# Altium schematic sheet FPGA_IO.SchDoc: FPGA IO
size 635 x 635 mm; Organization: UCLA High Energy Physics; DocumentNumber: 9; Revision: 2.0; SheetNumber: 9; SheetTotal: 23; CurrentDate: 9/6/2018; ModifiedDate: 9/6/2018; ProjectName: ALCT S-6 Optical Mezzanine
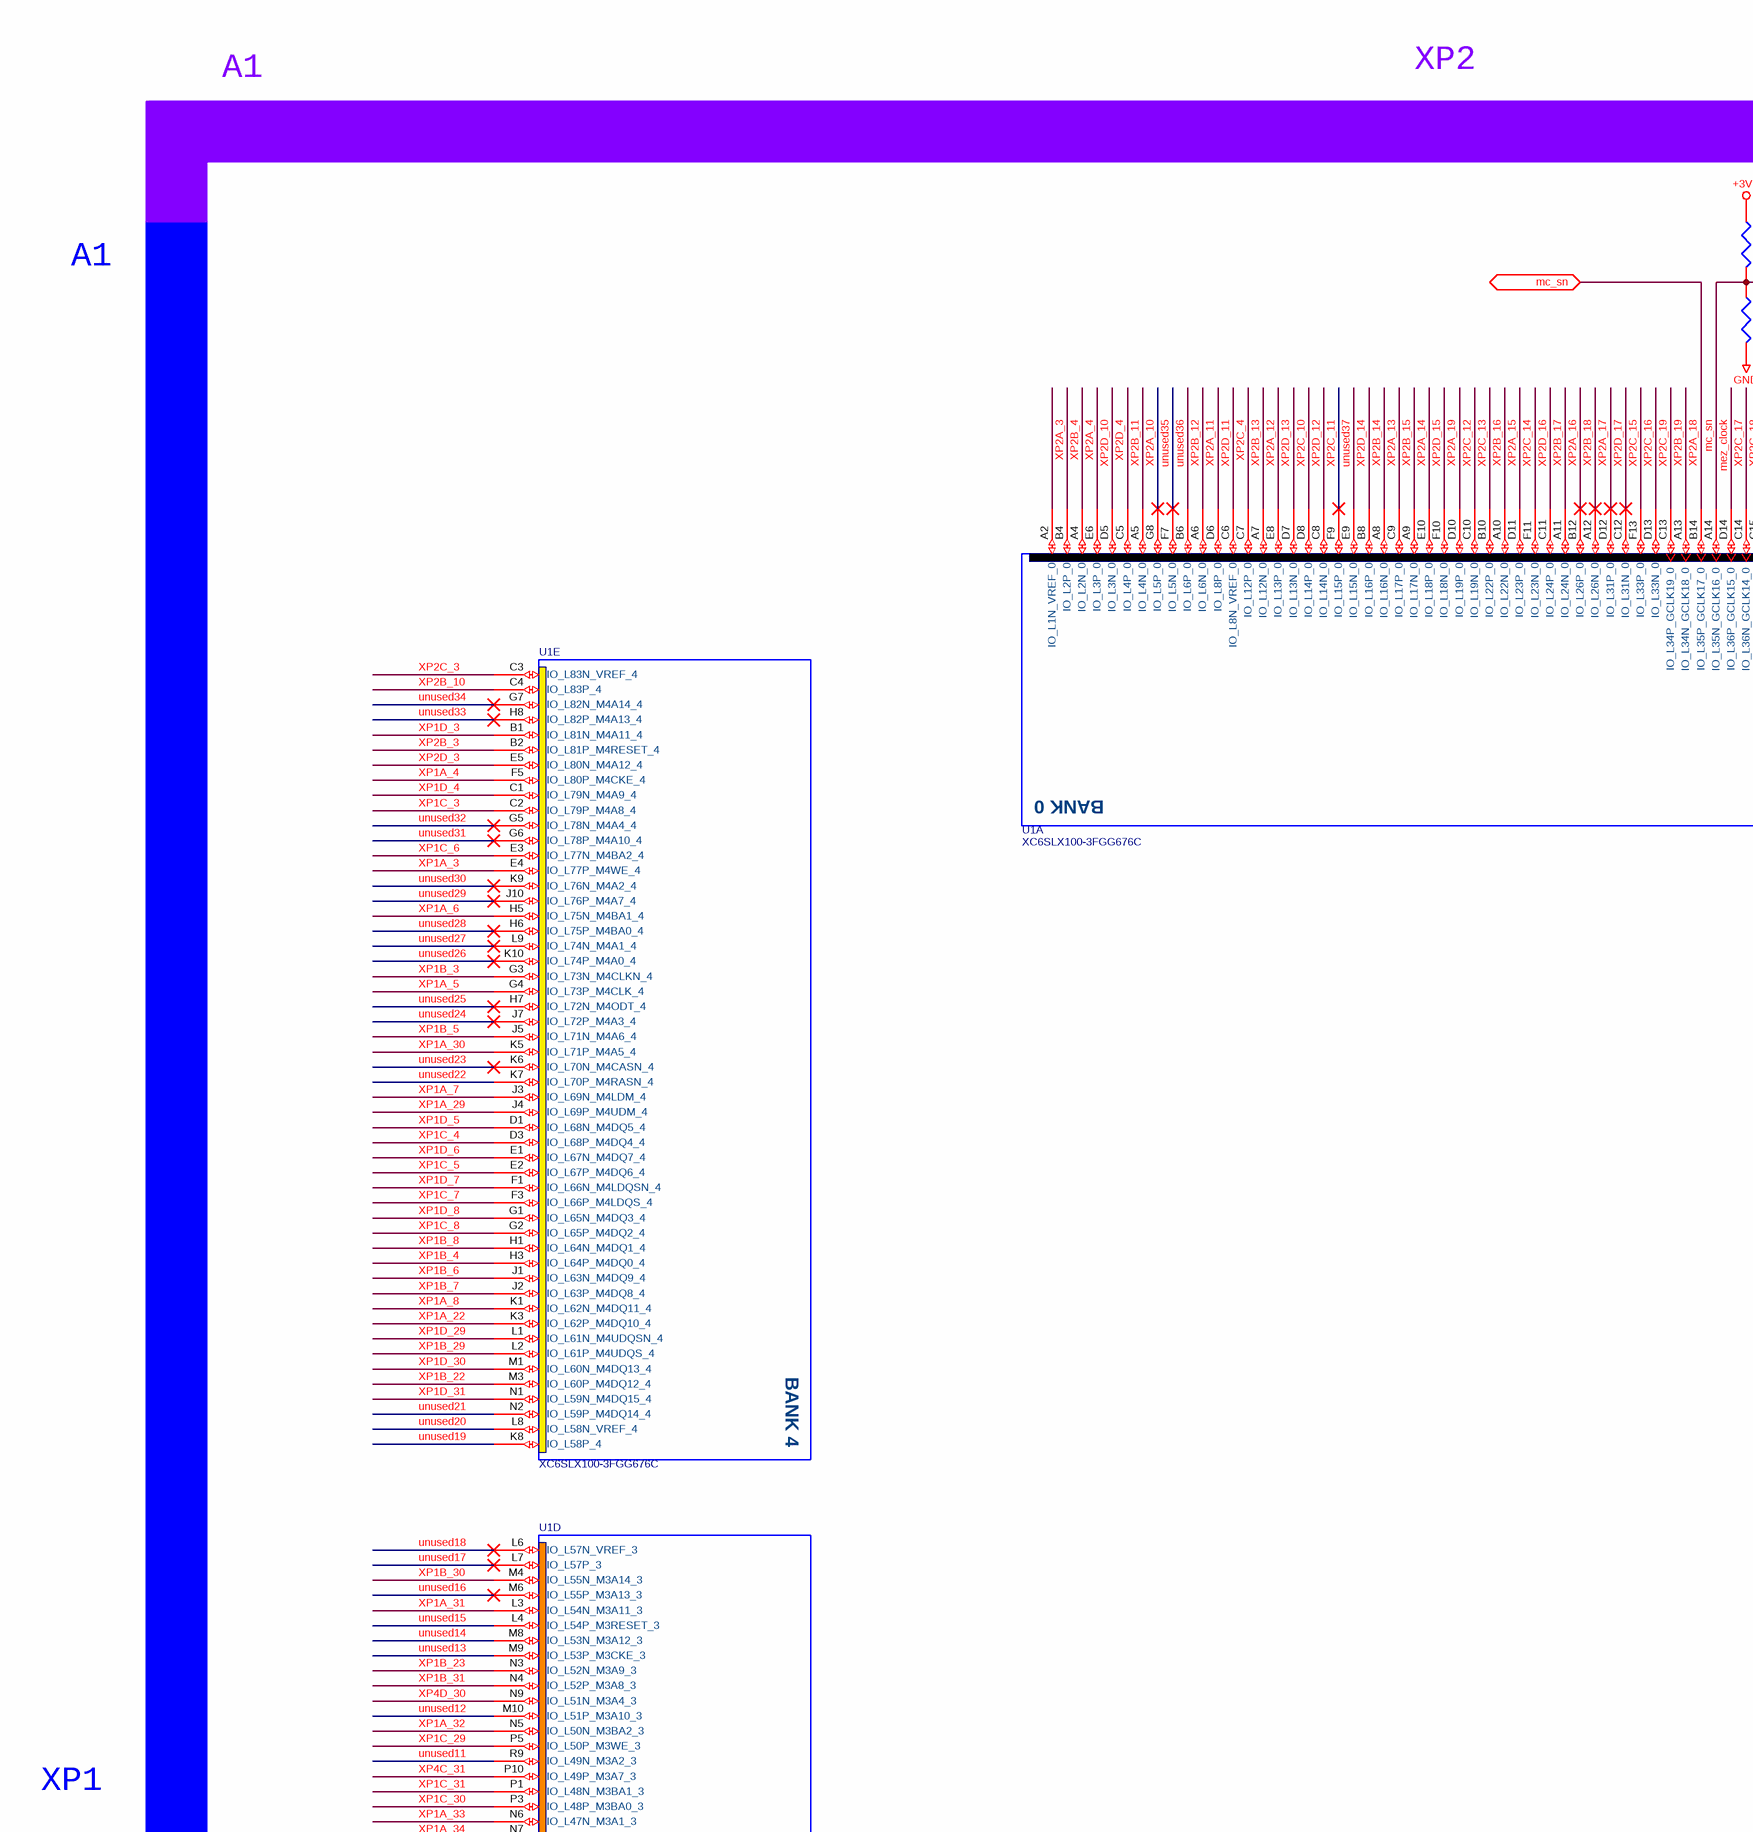
[diagram p0: FPGA_IO.SchDoc, top left]
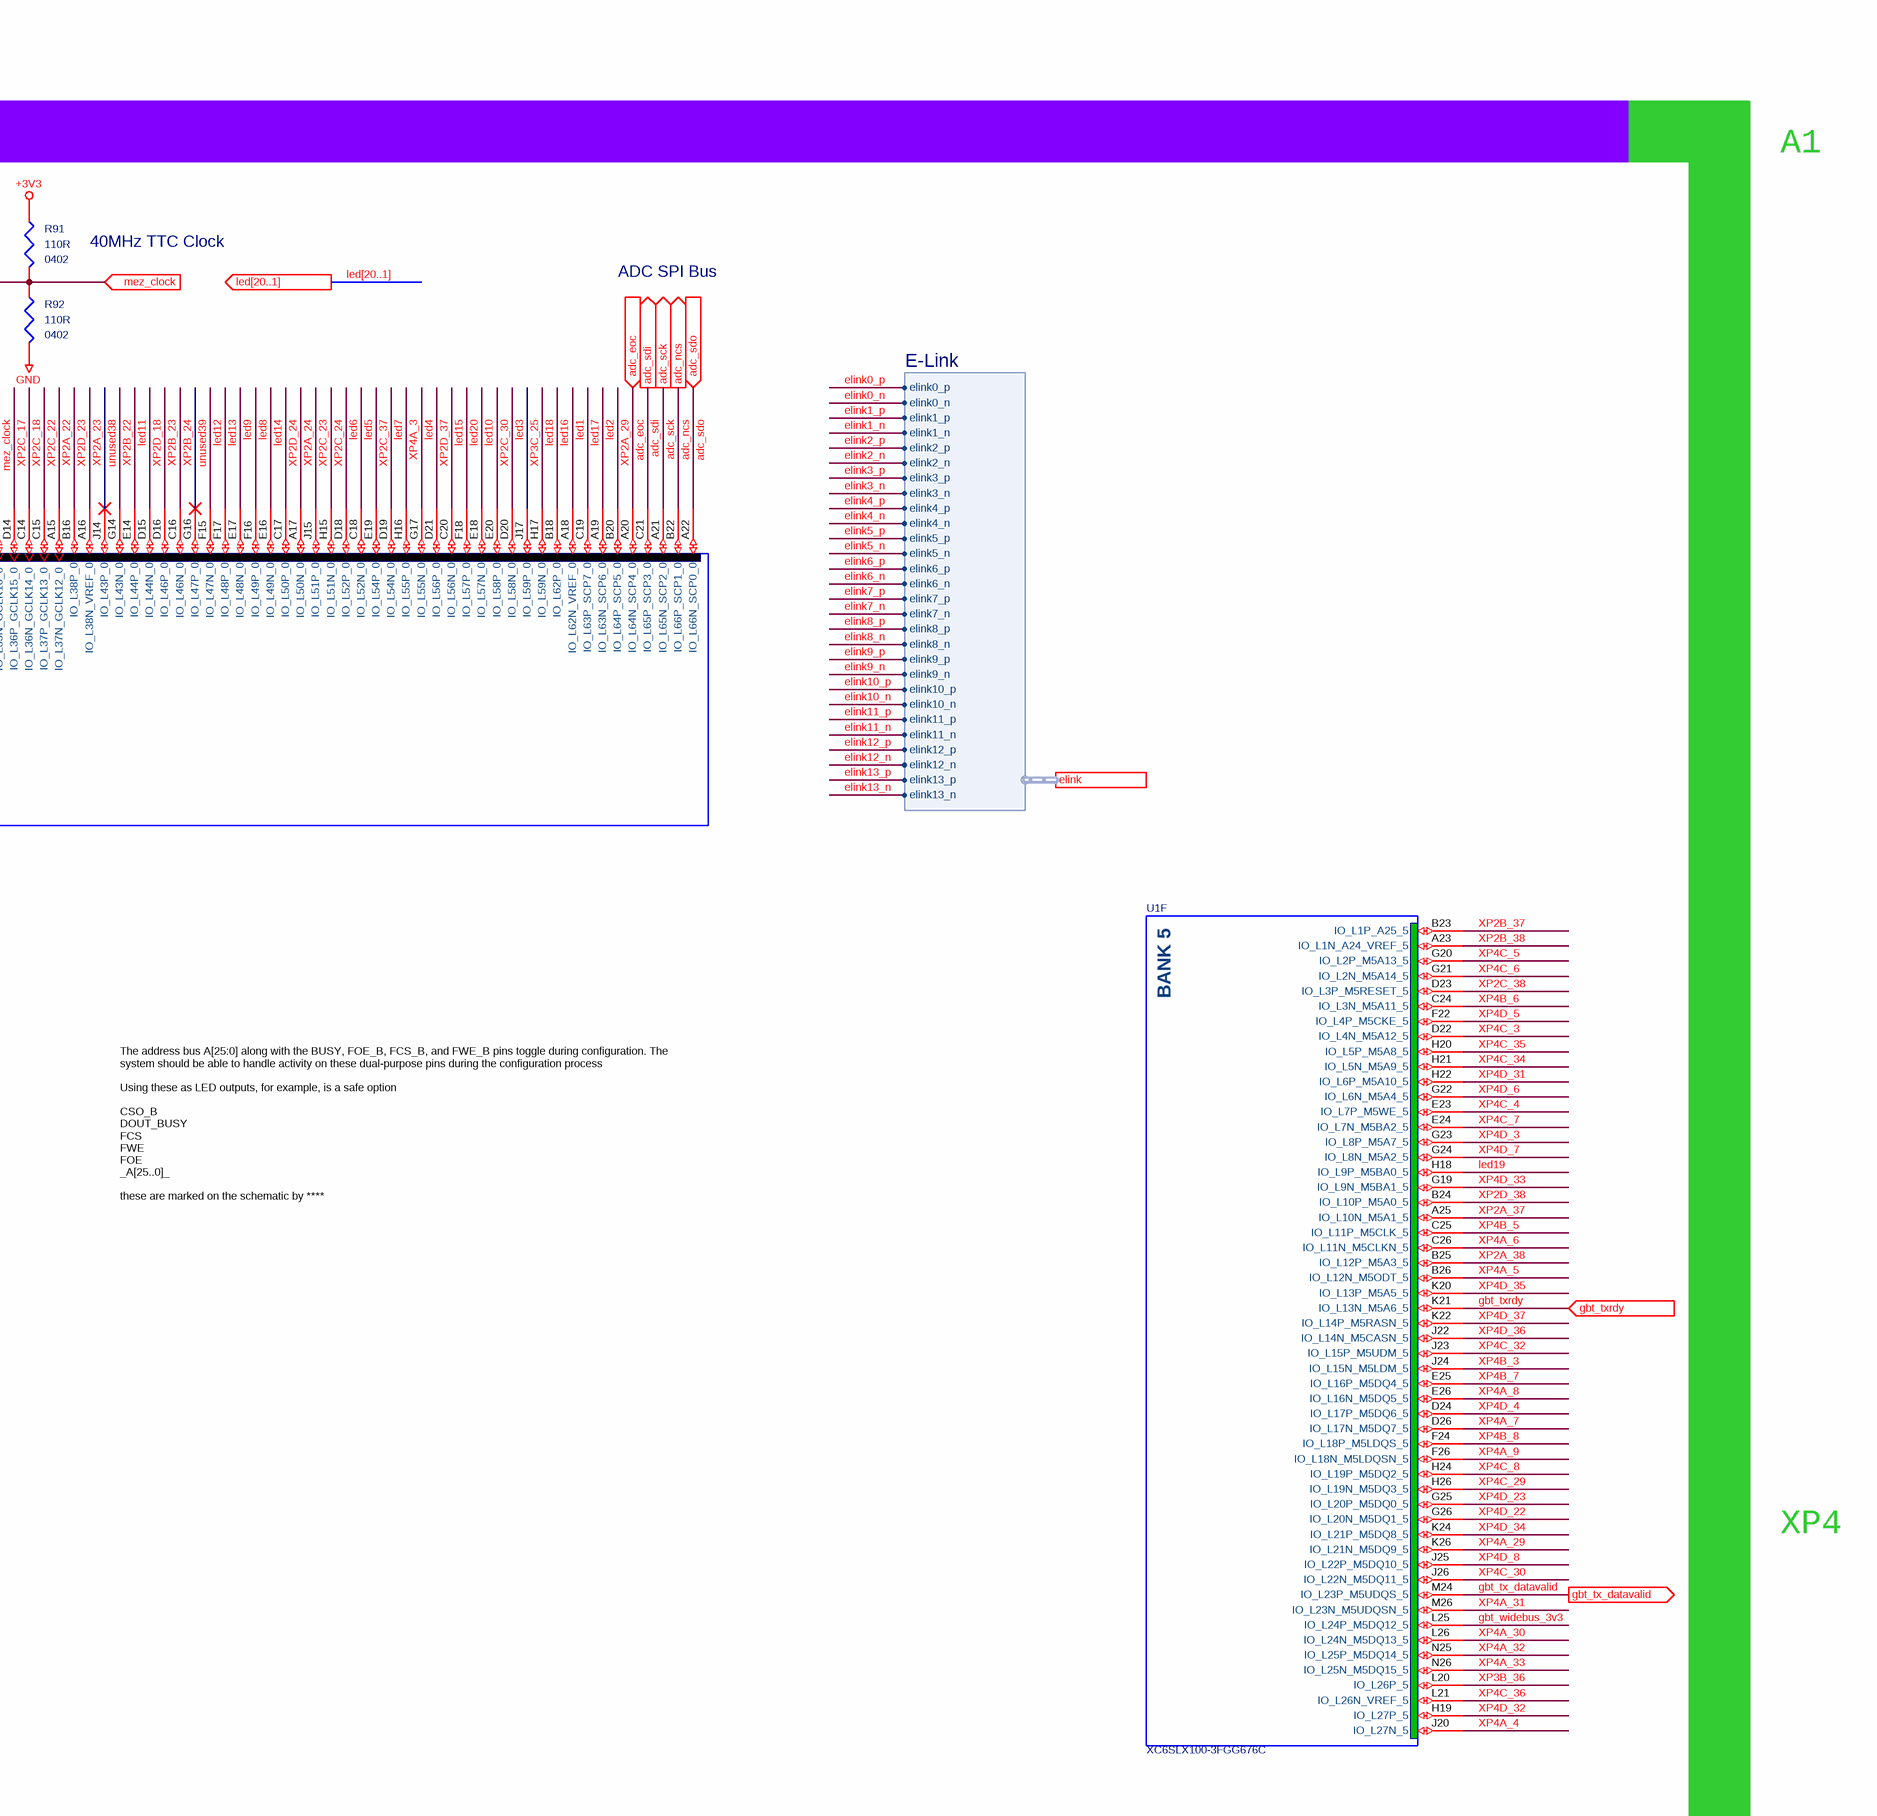
[diagram p1: FPGA_IO.SchDoc, top right]
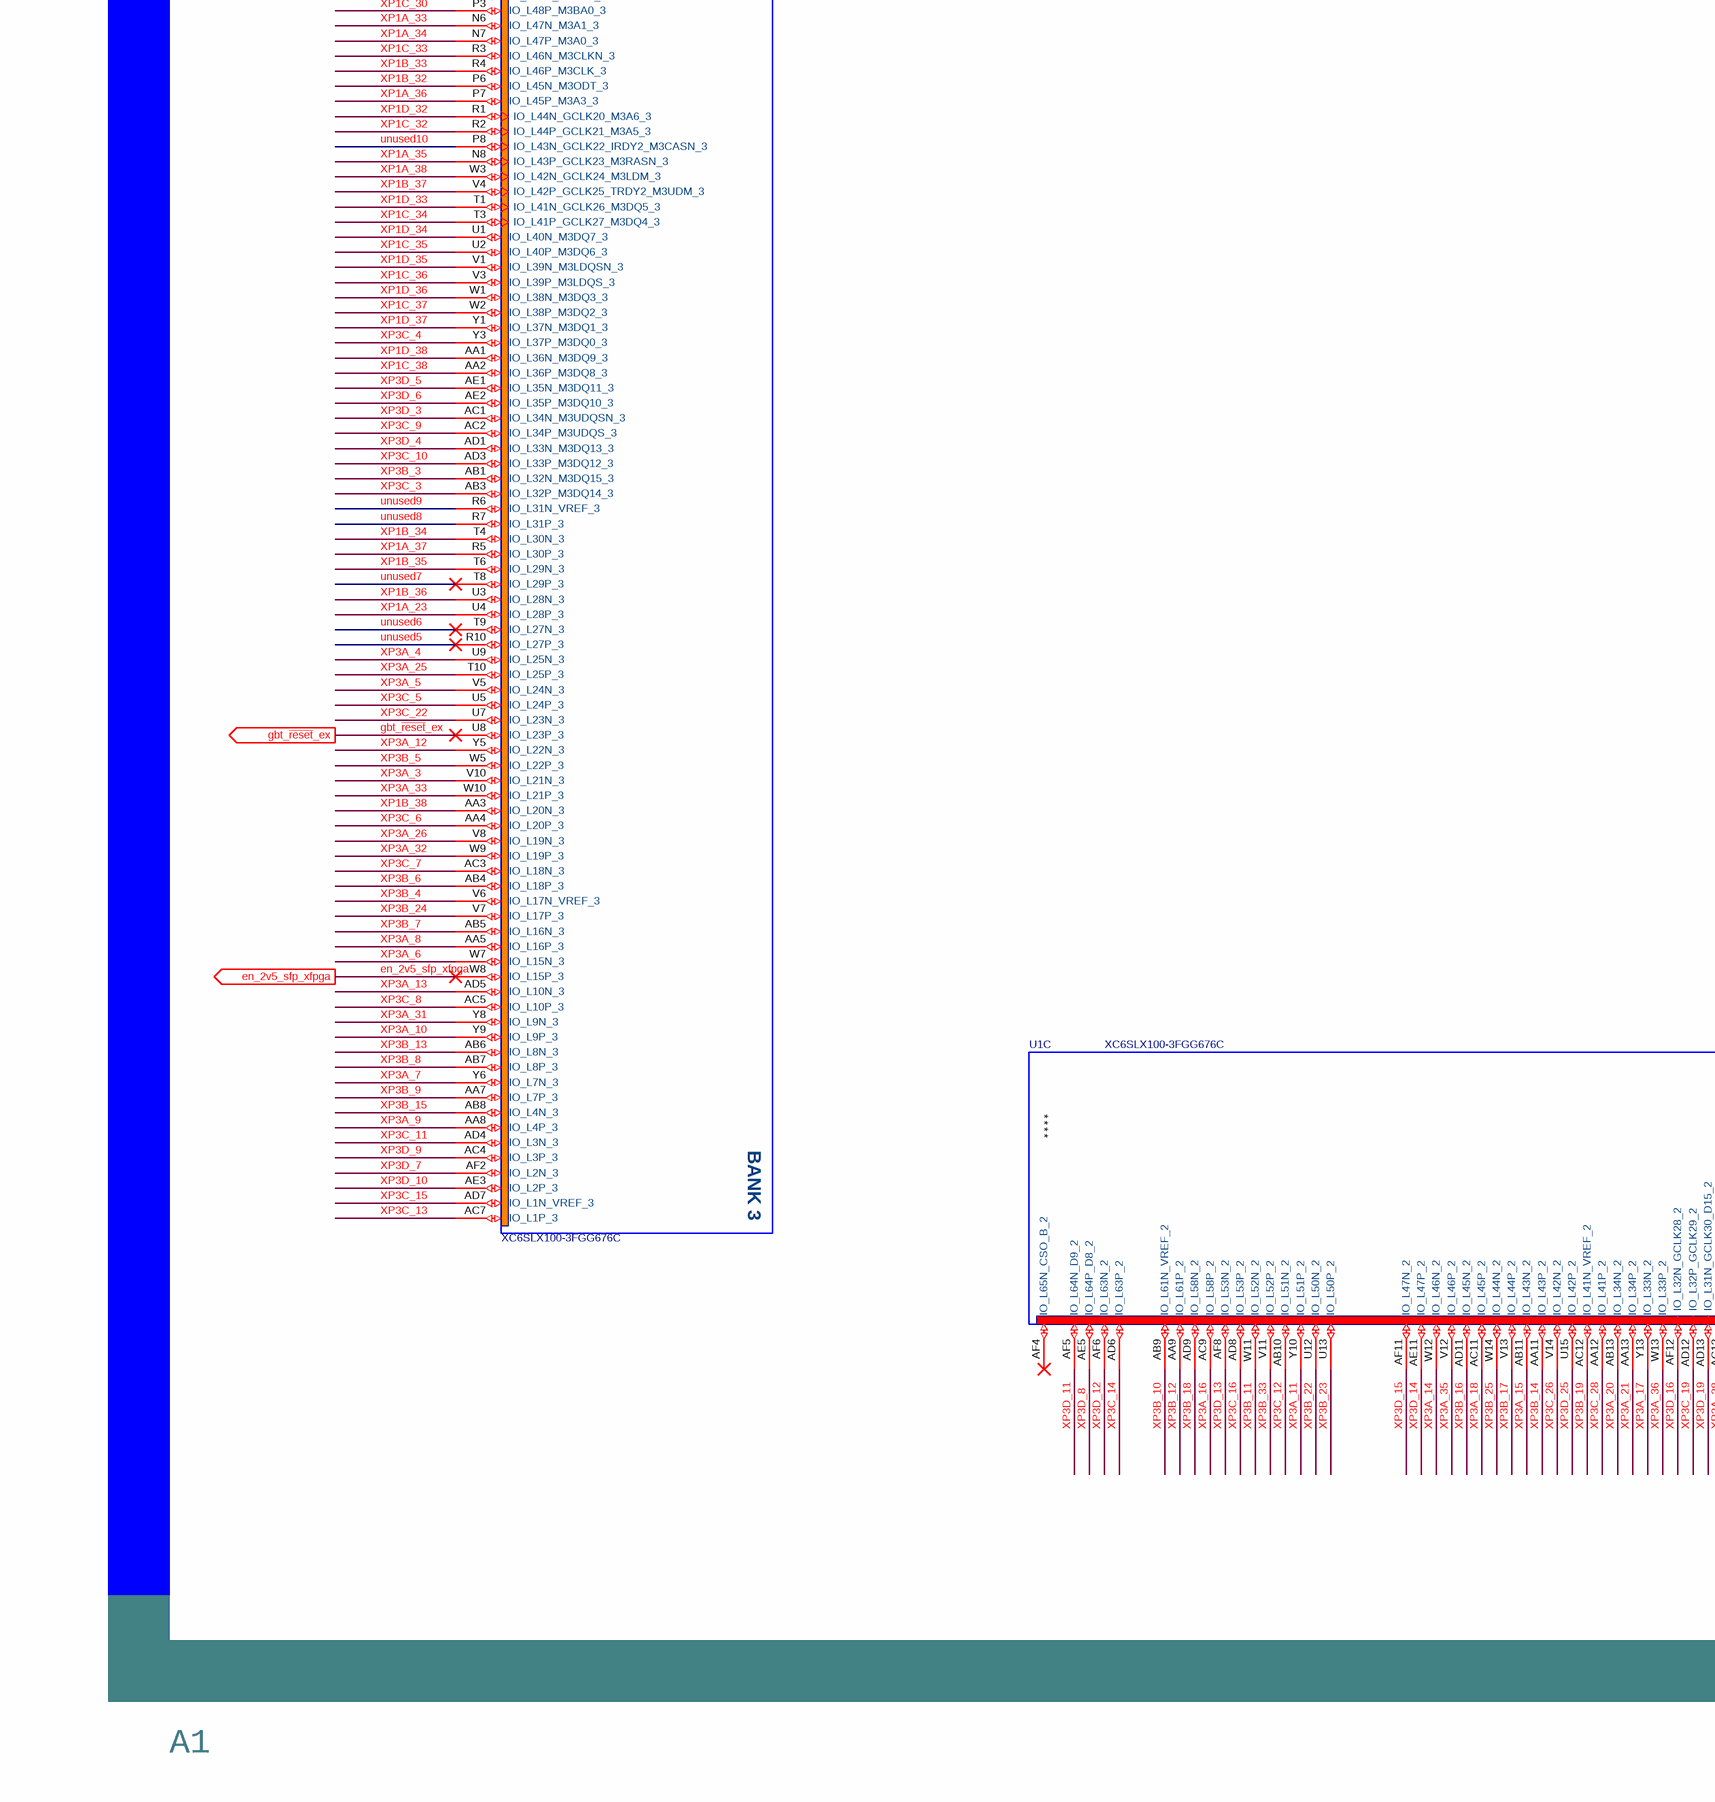
[diagram p2: FPGA_IO.SchDoc, bottom left]
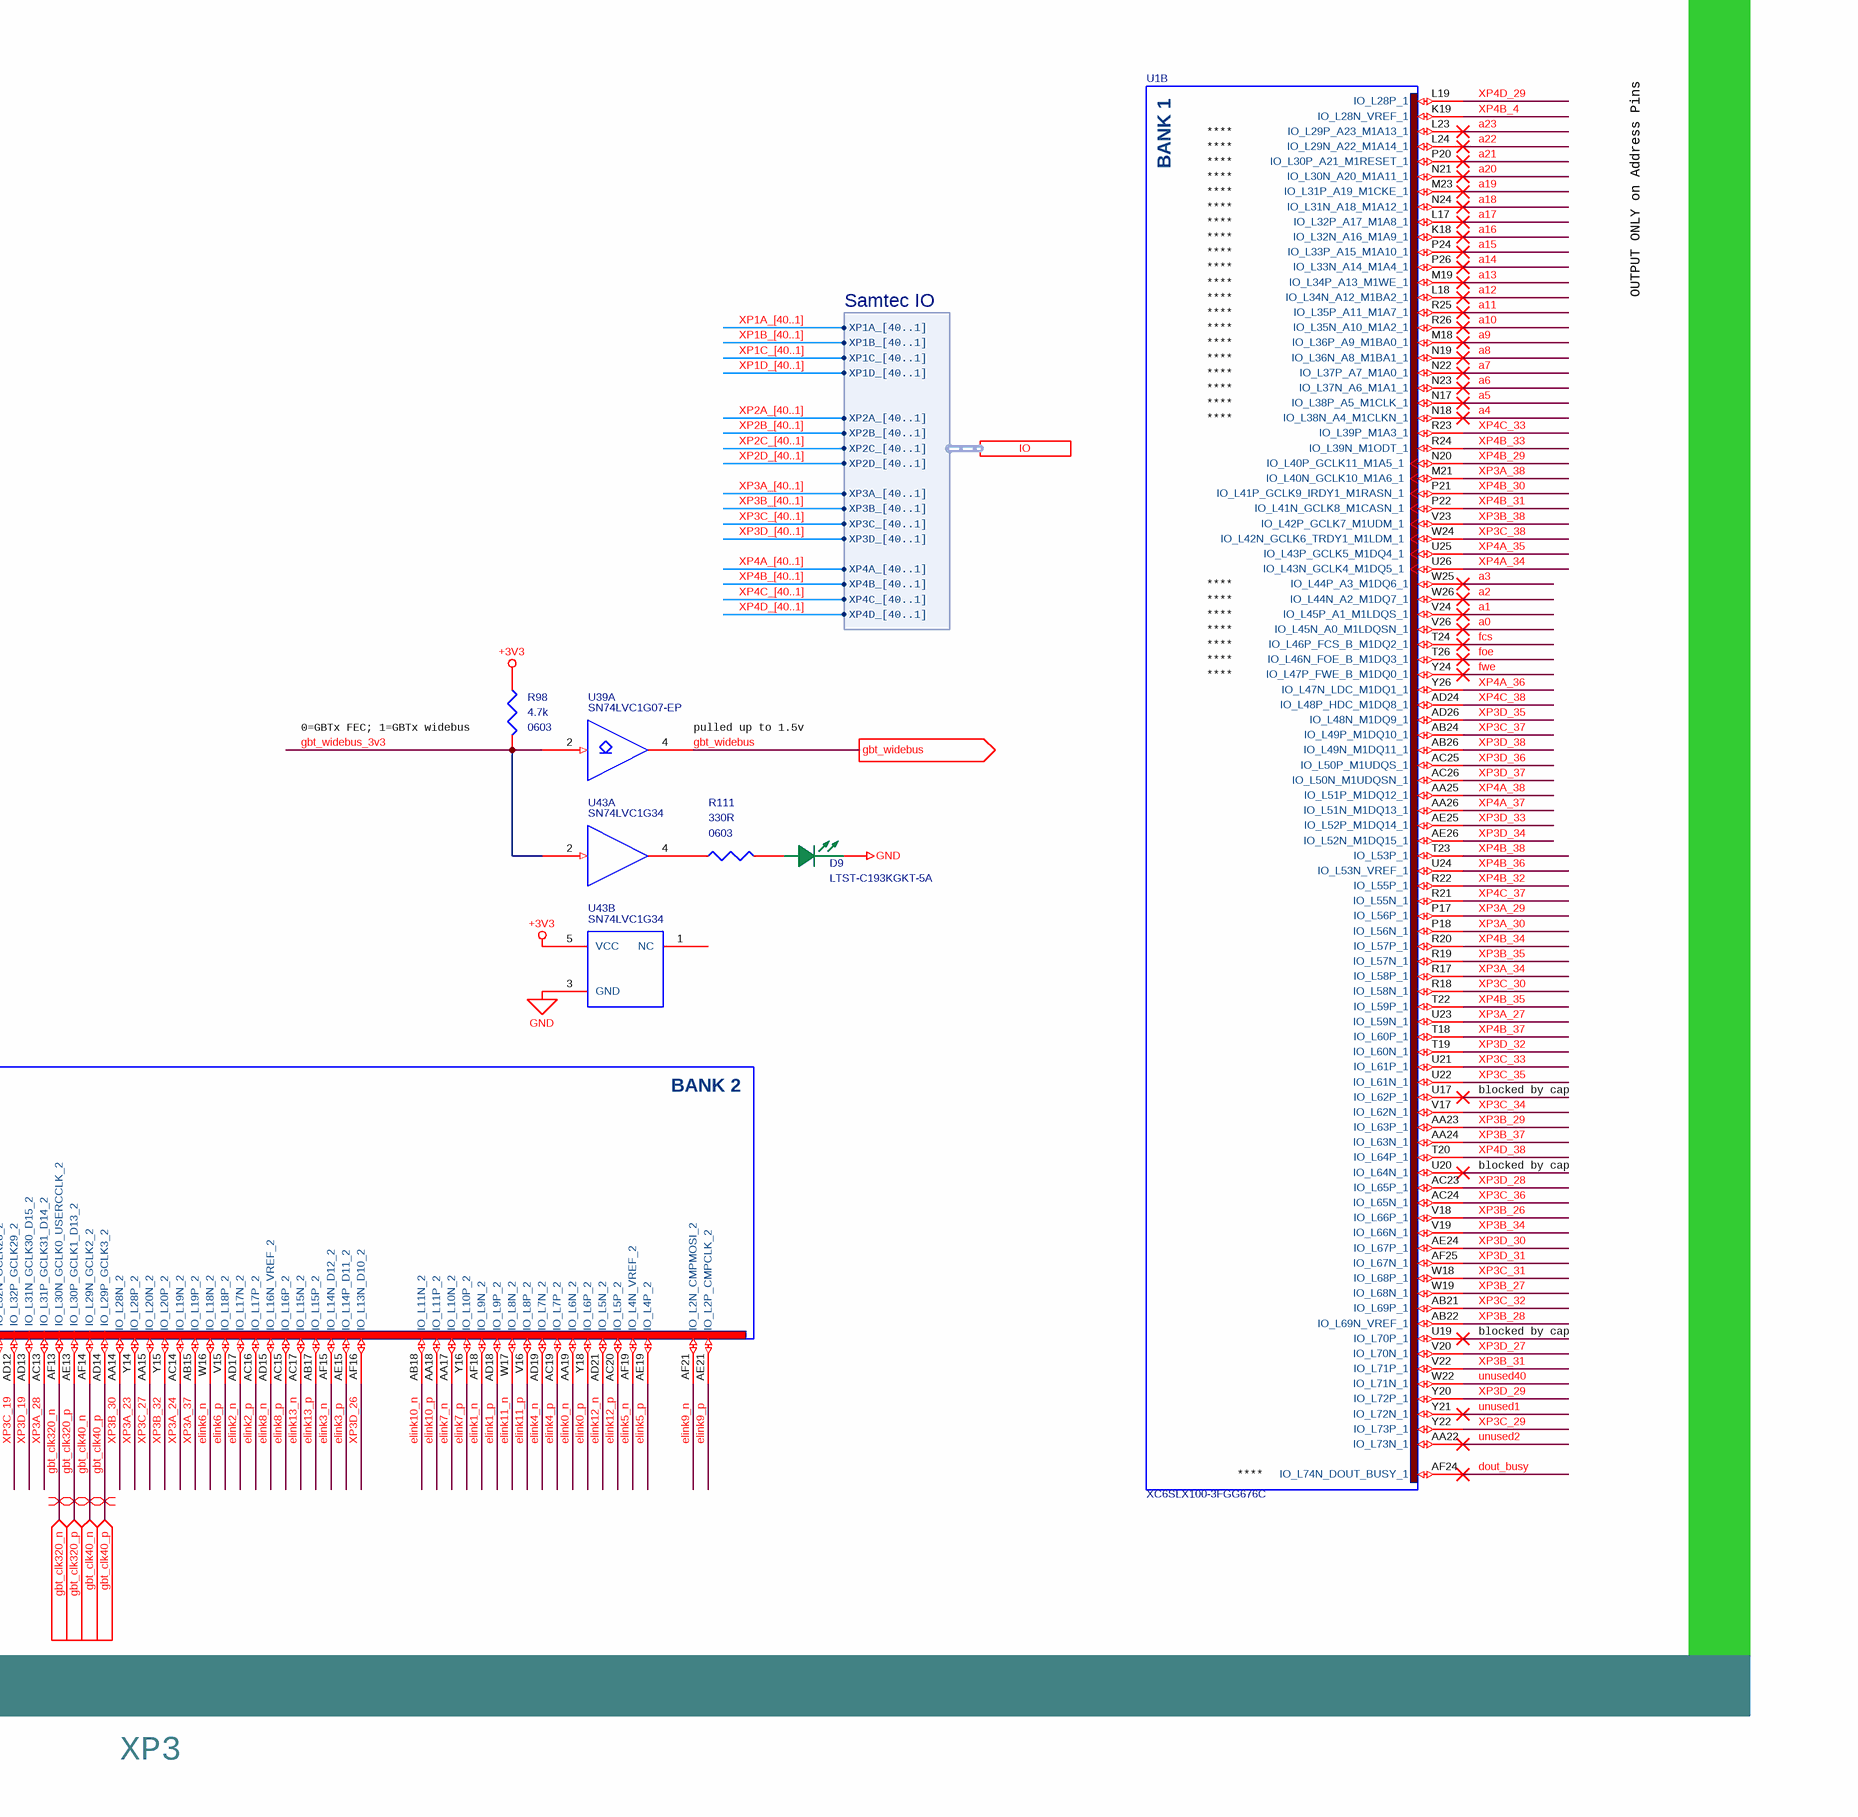
[diagram p3: FPGA_IO.SchDoc, bottom right]

## Parts
D9  LTST-C193KGKT-5A  [MC_S6/SM/LED_0603]
R91  110R  Supplier Device Package: 0402  [MC_S6/SM/R_0402_IPC]
R92  110R  Supplier Device Package: 0402  [MC_S6/SM/R_0402_IPC]
R98  4.7k  Supplier Device Package: 0603  [MC_S6/SM/R_0603_IPC]
R111  330R  Supplier Device Package: 0603  [MC_S6/SM/R_0603_IPC]
U1  XC6SLX100-3FGG676C  [FGG676]  (parts A,B,C,D,E,F of 10)
U39  SN74LVC1G07-EP  [SOT353-1]  (part A of 2)
U43  SN74LVC1G34  [MC_S6/SM/SOT_553_DRL5]  (parts A,B of 2)

## Ports
adc_eoc (in), adc_ncs (out), adc_sck (out), adc_sdi (out), adc_sdo (in), elink (harness E-Link), en_2v5_sfp_xfpga (out), gbt_clk40_n (in), gbt_clk40_p (in), gbt_clk320_n (in), gbt_clk320_p (in), gbt_tx_datavalid (out), gbt_txrdy (in), gbt_widebus (out), gbt_~{reset}_ex (out), IO (harness Samtec IO), led[20..1] (out), mc_sn (bidir), mez_clock (in)

## Harnesses
Samtec IO: XP1A_[40..1], XP1B_[40..1], XP1C_[40..1], XP1D_[40..1], XP2A_[40..1], XP2B_[40..1], XP2C_[40..1], XP2D_[40..1], XP3A_[40..1], XP3B_[40..1], XP3C_[40..1], XP3D_[40..1], XP4A_[40..1], XP4B_[40..1], XP4C_[40..1], XP4D_[40..1]
E-Link: elink0_p, elink0_n, elink1_p, elink1_n, elink2_p, elink2_n, elink3_p, elink3_n, elink4_p, elink4_n, elink5_p, elink5_n, elink6_p, elink6_n, elink7_p, elink7_n, elink8_p, elink8_n, elink9_p, elink9_n, elink10_p, elink10_n, elink11_p, elink11_n, elink12_p, elink12_n, elink13_p, elink13_n

## Nets
+3V3: R91.1 R98.1 U43.5(VCC)
GND: D9.K(CATHODE) R92.2 U43.3(GND)
a0: U1.V26(IO_L45N_A0_M1LDQSN_1)
a1: U1.V24(IO_L45P_A1_M1LDQS_1)
a2: U1.W26(IO_L44N_A2_M1DQ7_1)
a3: U1.W25(IO_L44P_A3_M1DQ6_1)
a4: U1.N18(IO_L38N_A4_M1CLKN_1)
a5: U1.N17(IO_L38P_A5_M1CLK_1)
a6: U1.N23(IO_L37N_A6_M1A1_1)
a7: U1.N22(IO_L37P_A7_M1A0_1)
a8: U1.N19(IO_L36N_A8_M1BA1_1)
a9: U1.M18(IO_L36P_A9_M1BA0_1)
a10: U1.R26(IO_L35N_A10_M1A2_1)
a11: U1.R25(IO_L35P_A11_M1A7_1)
a12: U1.L18(IO_L34N_A12_M1BA2_1)
a13: U1.M19(IO_L34P_A13_M1WE_1)
a14: U1.P26(IO_L33N_A14_M1A4_1)
a15: U1.P24(IO_L33P_A15_M1A10_1)
a16: U1.K18(IO_L32N_A16_M1A9_1)
a17: U1.L17(IO_L32P_A17_M1A8_1)
a18: U1.N24(IO_L31N_A18_M1A12_1)
a19: U1.M23(IO_L31P_A19_M1CKE_1)
a20: U1.N21(IO_L30N_A20_M1A11_1)
a21: U1.P20(IO_L30P_A21_M1RESET_1)
a22: U1.L24(IO_L29N_A22_M1A14_1)
a23: U1.L23(IO_L29P_A23_M1A13_1)
adc_eoc: U1.A20(IO_L64N_SCP4_0) ; port adc_eoc
adc_ncs: U1.B22(IO_L66P_SCP1_0) ; port adc_ncs
adc_sck: U1.A21(IO_L65N_SCP2_0) ; port adc_sck
adc_sdi: U1.C21(IO_L65P_SCP3_0) ; port adc_sdi
adc_sdo: U1.A22(IO_L66N_SCP0_0) ; port adc_sdo
dout_busy: U1.AF24(IO_L74N_DOUT_BUSY_1)
elink0_n: U1.AA19(IO_L6N_2) ; port elink.elink0_n
elink0_p: U1.Y18(IO_L6P_2) ; port elink.elink0_p
elink1_n: U1.AF18(IO_L9N_2) ; port elink.elink1_n
elink1_p: U1.AD18(IO_L9P_2) ; port elink.elink1_p
elink2_n: U1.AD17(IO_L17N_2) ; port elink.elink2_n
elink2_p: U1.AC16(IO_L17P_2) ; port elink.elink2_p
elink3_n: U1.AF15(IO_L14N_D12_2) ; port elink.elink3_n
elink3_p: U1.AE15(IO_L14P_D11_2) ; port elink.elink3_p
elink4_n: U1.AD19(IO_L7N_2) ; port elink.elink4_n
elink4_p: U1.AC19(IO_L7P_2) ; port elink.elink4_p
elink5_n: U1.AF19(IO_L4N_VREF_2) ; port elink.elink5_n
elink5_p: U1.AE19(IO_L4P_2) ; port elink.elink5_p
elink6_n: U1.W16(IO_L18N_2) ; port elink.elink6_n
elink6_p: U1.V15(IO_L18P_2) ; port elink.elink6_p
elink7_n: U1.AA17(IO_L10N_2) ; port elink.elink7_n
elink7_p: U1.Y16(IO_L10P_2) ; port elink.elink7_p
elink8_n: U1.AD15(IO_L16N_VREF_2) ; port elink.elink8_n
elink8_p: U1.AC15(IO_L16P_2) ; port elink.elink8_p
elink9_n: U1.AF21(IO_L2N_CMPMOSI_2) ; port elink.elink9_n
elink9_p: U1.AE21(IO_L2P_CMPCLK_2) ; port elink.elink9_p
elink10_n: U1.AB18(IO_L11N_2) ; port elink.elink10_n
elink10_p: U1.AA18(IO_L11P_2) ; port elink.elink10_p
elink11_n: U1.W17(IO_L8N_2) ; port elink.elink11_n
elink11_p: U1.V16(IO_L8P_2) ; port elink.elink11_p
elink12_n: U1.AD21(IO_L5N_2) ; port elink.elink12_n
elink12_p: U1.AC20(IO_L5P_2) ; port elink.elink12_p
elink13_n: U1.AC17(IO_L15N_2) ; port elink.elink13_n
elink13_p: U1.AB17(IO_L15P_2) ; port elink.elink13_p
en_2v5_sfp_xfpga: U1.W8(IO_L15P_3) ; port en_2v5_sfp_xfpga
fcs: U1.T24(IO_L46P_FCS_B_M1DQ2_1)
foe: U1.T26(IO_L46N_FOE_B_M1DQ3_1)
fwe: U1.Y24(IO_L47P_FWE_B_M1DQ0_1)
gbt_clk40_n: U1.AF14(IO_L29N_GCLK2_2) ; port gbt_clk40_n
gbt_clk40_p: U1.AD14(IO_L29P_GCLK3_2) ; port gbt_clk40_p
gbt_clk320_n: U1.AF13(IO_L30N_GCLK0_USERCCLK_2) ; port gbt_clk320_n
gbt_clk320_p: U1.AE13(IO_L30P_GCLK1_D13_2) ; port gbt_clk320_p
gbt_~{reset}_ex: U1.U8(IO_L23P_3) ; port gbt_~{reset}_ex
gbt_tx_datavalid: U1.M24(IO_L23P_M5UDQS_5) ; port gbt_tx_datavalid
gbt_txrdy: U1.K21(IO_L13N_M5A6_5) ; port gbt_txrdy
gbt_widebus: U39.4(Y) ; port gbt_widebus
gbt_widebus_3v3: R98.2 U1.L25(IO_L24P_M5DQ12_5) U39.2(A) U43.2(A)
led1: U1.A18(IO_L62N_VREF_0)
led2: U1.A19(IO_L63N_SCP6_0)
led3: U1.D20(IO_L58N_0)
led4: U1.G17(IO_L55N_0)
led5: U1.C18(IO_L52N_0)
led6: U1.D18(IO_L52P_0)
led7: U1.D19(IO_L54N_0)
led8: U1.F16(IO_L49P_0)
led9: U1.E17(IO_L48N_0)
led10: U1.E18(IO_L57N_0)
led11: U1.E14(IO_L44P_0)
led12: U1.F15(IO_L47N_0)
led13: U1.F17(IO_L48P_0)
led14: U1.E16(IO_L49N_0)
led15: U1.C20(IO_L56N_0)
led16: U1.B18(IO_L62P_0)
led17: U1.C19(IO_L63P_SCP7_0)
led18: U1.H17(IO_L59N_0)
led19: U1.H18(IO_L9P_M5BA0_5)
led20: U1.F18(IO_L57P_0)
mc_sn: U1.B14(IO_L35P_GCLK17_0) ; port mc_sn
mez_clock: R91.2 R92.1 U1.A14(IO_L35N_GCLK16_0) ; port mez_clock
unused1: U1.Y21(IO_L72N_1)
unused2: U1.AA22(IO_L73N_1)
unused5: U1.R10(IO_L27P_3)
unused6: U1.T9(IO_L27N_3)
unused7: U1.T8(IO_L29P_3)
unused8: U1.R7(IO_L31P_3)
unused9: U1.R6(IO_L31N_VREF_3)
unused10: U1.P8(IO_L43N_GCLK22_IRDY2_M3CASN_3)
unused11: U1.R9(IO_L49N_M3A2_3)
unused12: U1.M10(IO_L51P_M3A10_3)
unused13: U1.M9(IO_L53P_M3CKE_3)
unused14: U1.M8(IO_L53N_M3A12_3)
unused15: U1.L4(IO_L54P_M3RESET_3)
unused16: U1.M6(IO_L55P_M3A13_3)
unused17: U1.L7(IO_L57P_3)
unused18: U1.L6(IO_L57N_VREF_3)
unused19: U1.K8(IO_L58P_4)
unused20: U1.L8(IO_L58N_VREF_4)
unused21: U1.N2(IO_L59P_M4DQ14_4)
unused22: U1.K7(IO_L70P_M4RASN_4)
unused23: U1.K6(IO_L70N_M4CASN_4)
unused24: U1.J7(IO_L72P_M4A3_4)
unused25: U1.H7(IO_L72N_M4ODT_4)
unused26: U1.K10(IO_L74P_M4A0_4)
unused27: U1.L9(IO_L74N_M4A1_4)
unused28: U1.H6(IO_L75P_M4BA0_4)
unused29: U1.J10(IO_L76P_M4A7_4)
unused30: U1.K9(IO_L76N_M4A2_4)
unused31: U1.G6(IO_L78P_M4A10_4)
unused32: U1.G5(IO_L78N_M4A4_4)
unused33: U1.H8(IO_L82P_M4A13_4)
unused34: U1.G7(IO_L82N_M4A14_4)
unused35: U1.G8(IO_L5P_0)
unused36: U1.F7(IO_L5N_0)
unused37: U1.F9(IO_L15P_0)
unused38: U1.J14(IO_L43P_0)
unused39: U1.G16(IO_L47P_0)
unused40: U1.W22(IO_L71N_1)
XP1A_3: U1.E4(IO_L77P_M4WE_4)
XP1A_4: U1.F5(IO_L80P_M4CKE_4)
XP1A_5: U1.G4(IO_L73P_M4CLK_4)
XP1A_6: U1.H5(IO_L75N_M4BA1_4)
XP1A_7: U1.J3(IO_L69N_M4LDM_4)
XP1A_8: U1.K1(IO_L62N_M4DQ11_4)
XP1A_22: U1.K3(IO_L62P_M4DQ10_4)
XP1A_23: U1.U4(IO_L28P_3)
XP1A_29: U1.J4(IO_L69P_M4UDM_4)
XP1A_30: U1.K5(IO_L71P_M4A5_4)
XP1A_31: U1.L3(IO_L54N_M3A11_3)
XP1A_32: U1.N5(IO_L50N_M3BA2_3)
XP1A_33: U1.N6(IO_L47N_M3A1_3)
XP1A_34: U1.N7(IO_L47P_M3A0_3)
XP1A_35: U1.N8(IO_L43P_GCLK23_M3RASN_3)
XP1A_36: U1.P7(IO_L45P_M3A3_3)
XP1A_37: U1.R5(IO_L30P_3)
XP1A_38: U1.W3(IO_L42N_GCLK24_M3LDM_3)
XP1B_3: U1.G3(IO_L73N_M4CLKN_4)
XP1B_4: U1.H3(IO_L64P_M4DQ0_4)
XP1B_5: U1.J5(IO_L71N_M4A6_4)
XP1B_6: U1.J1(IO_L63N_M4DQ9_4)
XP1B_7: U1.J2(IO_L63P_M4DQ8_4)
XP1B_8: U1.H1(IO_L64N_M4DQ1_4)
XP1B_22: U1.M3(IO_L60P_M4DQ12_4)
XP1B_23: U1.N3(IO_L52N_M3A9_3)
XP1B_29: U1.L2(IO_L61P_M4UDQS_4)
XP1B_30: U1.M4(IO_L55N_M3A14_3)
XP1B_31: U1.N4(IO_L52P_M3A8_3)
XP1B_32: U1.P6(IO_L45N_M3ODT_3)
XP1B_33: U1.R4(IO_L46P_M3CLK_3)
XP1B_34: U1.T4(IO_L30N_3)
XP1B_35: U1.T6(IO_L29N_3)
XP1B_36: U1.U3(IO_L28N_3)
XP1B_37: U1.V4(IO_L42P_GCLK25_TRDY2_M3UDM_3)
XP1B_38: U1.AA3(IO_L20N_3)
XP1C_3: U1.C2(IO_L79P_M4A8_4)
XP1C_4: U1.D3(IO_L68P_M4DQ4_4)
XP1C_5: U1.E2(IO_L67P_M4DQ6_4)
XP1C_6: U1.E3(IO_L77N_M4BA2_4)
XP1C_7: U1.F3(IO_L66P_M4LDQS_4)
XP1C_8: U1.G2(IO_L65P_M4DQ2_4)
XP1C_29: U1.P5(IO_L50P_M3WE_3)
XP1C_30: U1.P3(IO_L48P_M3BA0_3)
XP1C_31: U1.P1(IO_L48N_M3BA1_3)
XP1C_32: U1.R2(IO_L44P_GCLK21_M3A5_3)
XP1C_33: U1.R3(IO_L46N_M3CLKN_3)
XP1C_34: U1.T3(IO_L41P_GCLK27_M3DQ4_3)
XP1C_35: U1.U2(IO_L40P_M3DQ6_3)
XP1C_36: U1.V3(IO_L39P_M3LDQS_3)
XP1C_37: U1.W2(IO_L38P_M3DQ2_3)
XP1C_38: U1.AA2(IO_L36P_M3DQ8_3)
XP1D_3: U1.B1(IO_L81N_M4A11_4)
XP1D_4: U1.C1(IO_L79N_M4A9_4)
XP1D_5: U1.D1(IO_L68N_M4DQ5_4)
XP1D_6: U1.E1(IO_L67N_M4DQ7_4)
XP1D_7: U1.F1(IO_L66N_M4LDQSN_4)
XP1D_8: U1.G1(IO_L65N_M4DQ3_4)
XP1D_29: U1.L1(IO_L61N_M4UDQSN_4)
XP1D_30: U1.M1(IO_L60N_M4DQ13_4)
XP1D_31: U1.N1(IO_L59N_M4DQ15_4)
XP1D_32: U1.R1(IO_L44N_GCLK20_M3A6_3)
XP1D_33: U1.T1(IO_L41N_GCLK26_M3DQ5_3)
XP1D_34: U1.U1(IO_L40N_M3DQ7_3)
XP1D_35: U1.V1(IO_L39N_M3LDQSN_3)
XP1D_36: U1.W1(IO_L38N_M3DQ3_3)
XP1D_37: U1.Y1(IO_L37N_M3DQ1_3)
XP1D_38: U1.AA1(IO_L36N_M3DQ9_3)
XP2A_3: U1.A2(IO_L1N_VREF_0)
XP2A_4: U1.A4(IO_L2N_0)
XP2A_10: U1.A5(IO_L4N_0)
XP2A_11: U1.A6(IO_L6N_0)
XP2A_12: U1.A7(IO_L12N_0)
XP2A_13: U1.A8(IO_L16N_0)
XP2A_14: U1.A9(IO_L17N_0)
XP2A_15: U1.A10(IO_L22N_0)
XP2A_16: U1.A11(IO_L24N_0)
XP2A_17: U1.A12(IO_L26N_0)
XP2A_18: U1.A13(IO_L34N_GCLK18_0)
XP2A_19: U1.F10(IO_L18N_0)
XP2A_22: U1.A15(IO_L37N_GCLK12_0)
XP2A_23: U1.A16(IO_L38N_VREF_0)
XP2A_24: U1.A17(IO_L50N_0)
XP2A_29: U1.B20(IO_L64P_SCP5_0)
XP2A_37: U1.A25(IO_L10N_M5A1_5)
XP2A_38: U1.B25(IO_L12P_M5A3_5)
XP2B_3: U1.B2(IO_L81P_M4RESET_4)
XP2B_4: U1.B4(IO_L2P_0)
XP2B_10: U1.C4(IO_L83P_4)
XP2B_11: U1.C5(IO_L4P_0)
XP2B_12: U1.B6(IO_L6P_0)
XP2B_13: U1.C7(IO_L12P_0)
XP2B_14: U1.B8(IO_L16P_0)
XP2B_15: U1.C9(IO_L17P_0)
XP2B_16: U1.B10(IO_L22P_0)
XP2B_17: U1.C11(IO_L24P_0)
XP2B_18: U1.B12(IO_L26P_0)
XP2B_19: U1.C13(IO_L34P_GCLK19_0)
XP2B_22: U1.G14(IO_L43N_0)
XP2B_23: U1.D16(IO_L46P_0)
XP2B_24: U1.C16(IO_L46N_0)
XP2B_37: U1.B23(IO_L1P_A25_5)
XP2B_38: U1.A23(IO_L1N_A24_VREF_5)
XP2C_3: U1.C3(IO_L83N_VREF_4)
XP2C_4: U1.C6(IO_L8N_VREF_0)
XP2C_10: U1.D7(IO_L13N_0)
XP2C_11: U1.C8(IO_L14N_0)
XP2C_12: U1.D10(IO_L19P_0)
XP2C_13: U1.C10(IO_L19N_0)
XP2C_14: U1.D11(IO_L23P_0)
XP2C_15: U1.C12(IO_L31N_0)
XP2C_16: U1.F13(IO_L33P_0)
XP2C_17: U1.D14(IO_L36P_GCLK15_0)
XP2C_18: U1.C14(IO_L36N_GCLK14_0)
XP2C_19: U1.D13(IO_L33N_0)
XP2C_22: U1.C15(IO_L37P_GCLK13_0)
XP2C_23: U1.J15(IO_L51P_0)
XP2C_24: U1.H15(IO_L51N_0)
XP2C_30: U1.E20(IO_L58P_0)
XP2C_37: U1.E19(IO_L54P_0)
XP2C_38: U1.D23(IO_L3P_M5RESET_5)
XP2D_3: U1.E5(IO_L80N_M4A12_4)
XP2D_4: U1.D5(IO_L3N_0)
XP2D_10: U1.E6(IO_L3P_0)
XP2D_11: U1.D6(IO_L8P_0)
XP2D_12: U1.D8(IO_L14P_0)
XP2D_13: U1.E8(IO_L13P_0)
XP2D_14: U1.E9(IO_L15N_0)
XP2D_15: U1.E10(IO_L18P_0)
XP2D_16: U1.F11(IO_L23N_0)
XP2D_17: U1.D12(IO_L31P_0)
XP2D_18: U1.D15(IO_L44N_0)
XP2D_23: U1.B16(IO_L38P_0)
XP2D_24: U1.C17(IO_L50P_0)
XP2D_37: U1.D21(IO_L56P_0)
XP2D_38: U1.B24(IO_L10P_M5A0_5)
XP3A_3: U1.V10(IO_L21N_3)
XP3A_4: U1.U9(IO_L25N_3)
XP3A_5: U1.V5(IO_L24N_3)
XP3A_6: U1.W7(IO_L15N_3)
XP3A_7: U1.Y6(IO_L7N_3)
XP3A_8: U1.AA5(IO_L16P_3)
XP3A_9: U1.AA8(IO_L4P_3)
XP3A_10: U1.Y9(IO_L9P_3)
XP3A_11: U1.Y10(IO_L51P_2)
XP3A_12: U1.Y5(IO_L22N_3)
XP3A_13: U1.AD5(IO_L10N_3)
XP3A_14: U1.W12(IO_L46N_2)
XP3A_15: U1.AB11(IO_L43N_2)
XP3A_16: U1.AC9(IO_L58P_2)
XP3A_17: U1.Y13(IO_L33N_2)
XP3A_18: U1.AC11(IO_L45P_2)
XP3A_20: U1.AB13(IO_L34N_2)
XP3A_21: U1.AA13(IO_L34P_2)
XP3A_23: U1.Y14(IO_L28P_2)
XP3A_24: U1.AC14(IO_L19N_2)
XP3A_25: U1.T10(IO_L25P_3)
XP3A_26: U1.V8(IO_L19N_3)
XP3A_27: U1.U23(IO_L59N_1)
XP3A_28: U1.AC13(IO_L31P_GCLK31_D14_2)
XP3A_29: U1.P17(IO_L56P_1)
XP3A_30: U1.P18(IO_L56N_1)
XP3A_31: U1.Y8(IO_L9N_3)
XP3A_32: U1.W9(IO_L19P_3)
XP3A_33: U1.W10(IO_L21P_3)
XP3A_34: U1.R17(IO_L58P_1)
XP3A_35: U1.V12(IO_L46P_2)
XP3A_36: U1.W13(IO_L33P_2)
XP3A_37: U1.AB15(IO_L19P_2)
XP3A_38: U1.M21(IO_L40N_GCLK10_M1A6_1)
XP3B_3: U1.AB1(IO_L32N_M3DQ15_3)
XP3B_4: U1.V6(IO_L17N_VREF_3)
XP3B_5: U1.W5(IO_L22P_3)
XP3B_6: U1.AB4(IO_L18P_3)
XP3B_7: U1.AB5(IO_L16N_3)
XP3B_8: U1.AB7(IO_L8P_3)
XP3B_9: U1.AA7(IO_L7P_3)
XP3B_10: U1.AB9(IO_L61N_VREF_2)
XP3B_11: U1.W11(IO_L52N_2)
XP3B_12: U1.AA9(IO_L61P_2)
XP3B_13: U1.AB6(IO_L8N_3)
XP3B_14: U1.AA11(IO_L43P_2)
XP3B_15: U1.AB8(IO_L4N_3)
XP3B_16: U1.AD11(IO_L45N_2)
XP3B_17: U1.V13(IO_L44P_2)
XP3B_18: U1.AD9(IO_L58N_2)
XP3B_19: U1.AC12(IO_L41N_VREF_2)
XP3B_22: U1.U12(IO_L50N_2)
XP3B_23: U1.U13(IO_L50P_2)
XP3B_24: U1.V7(IO_L17P_3)
XP3B_25: U1.W14(IO_L44N_2)
XP3B_26: U1.V18(IO_L66P_1)
XP3B_27: U1.W19(IO_L68N_1)
XP3B_28: U1.AB22(IO_L69N_VREF_1)
XP3B_29: U1.AA23(IO_L63P_1)
XP3B_30: U1.AA14(IO_L28N_2)
XP3B_31: U1.V22(IO_L71P_1)
XP3B_32: U1.Y15(IO_L20P_2)
XP3B_33: U1.V11(IO_L52P_2)
XP3B_34: U1.V19(IO_L66N_1)
XP3B_35: U1.R19(IO_L57N_1)
XP3B_36: U1.L20(IO_L26P_5)
XP3B_37: U1.AA24(IO_L63N_1)
XP3B_38: U1.V23(IO_L42P_GCLK7_M1UDM_1)
XP3C_3: U1.AB3(IO_L32P_M3DQ14_3)
XP3C_4: U1.Y3(IO_L37P_M3DQ0_3)
XP3C_5: U1.U5(IO_L24P_3)
XP3C_6: U1.AA4(IO_L20P_3)
XP3C_7: U1.AC3(IO_L18N_3)
XP3C_8: U1.AC5(IO_L10P_3)
XP3C_9: U1.AC2(IO_L34P_M3UDQS_3)
XP3C_10: U1.AD3(IO_L33P_M3DQ12_3)
XP3C_11: U1.AD4(IO_L3N_3)
XP3C_12: U1.AB10(IO_L51N_2)
XP3C_13: U1.AC7(IO_L1P_3)
XP3C_14: U1.AD6(IO_L63P_2)
XP3C_15: U1.AD7(IO_L1N_VREF_3)
XP3C_16: U1.AD8(IO_L53P_2)
XP3C_19: U1.AD12(IO_L32P_GCLK29_2)
XP3C_22: U1.U7(IO_L23N_3)
XP3C_25: U1.J17(IO_L59P_0)
XP3C_26: U1.V14(IO_L42N_2)
XP3C_27: U1.AA15(IO_L20N_2)
XP3C_28: U1.AA12(IO_L41P_2)
XP3C_29: U1.Y22(IO_L73P_1)
XP3C_30: U1.R18(IO_L58N_1)
XP3C_31: U1.W18(IO_L68P_1)
XP3C_32: U1.AB21(IO_L69P_1)
XP3C_33: U1.U21(IO_L61P_1)
XP3C_34: U1.V17(IO_L62N_1)
XP3C_35: U1.U22(IO_L61N_1)
XP3C_36: U1.AC24(IO_L65N_1)
XP3C_37: U1.AB24(IO_L49P_M1DQ10_1)
XP3C_38: U1.W24(IO_L42N_GCLK6_TRDY1_M1LDM_1)
XP3D_3: U1.AC1(IO_L34N_M3UDQSN_3)
XP3D_4: U1.AD1(IO_L33N_M3DQ13_3)
XP3D_5: U1.AE1(IO_L35N_M3DQ11_3)
XP3D_6: U1.AE2(IO_L35P_M3DQ10_3)
XP3D_7: U1.AF2(IO_L2N_3)
XP3D_8: U1.AE5(IO_L64P_D8_2)
XP3D_9: U1.AC4(IO_L3P_3)
XP3D_10: U1.AE3(IO_L2P_3)
XP3D_11: U1.AF5(IO_L64N_D9_2)
XP3D_12: U1.AF6(IO_L63N_2)
XP3D_13: U1.AF8(IO_L53N_2)
XP3D_14: U1.AE11(IO_L47P_2)
XP3D_15: U1.AF11(IO_L47N_2)
XP3D_16: U1.AF12(IO_L32N_GCLK28_2)
XP3D_19: U1.AD13(IO_L31N_GCLK30_D15_2)
XP3D_25: U1.U15(IO_L42P_2)
XP3D_26: U1.AF16(IO_L13N_D10_2)
XP3D_27: U1.V20(IO_L70N_1)
XP3D_28: U1.AC23(IO_L65P_1)
XP3D_29: U1.Y20(IO_L72P_1)
XP3D_30: U1.AE24(IO_L67P_1)
XP3D_31: U1.AF25(IO_L67N_1)
XP3D_32: U1.T19(IO_L60N_1)
XP3D_33: U1.AE25(IO_L52P_M1DQ14_1)
XP3D_34: U1.AE26(IO_L52N_M1DQ15_1)
XP3D_35: U1.AD26(IO_L48N_M1DQ9_1)
XP3D_36: U1.AC25(IO_L50P_M1UDQS_1)
XP3D_37: U1.AC26(IO_L50N_M1UDQSN_1)
XP3D_38: U1.AB26(IO_L49N_M1DQ11_1)
XP4A_3: U1.H16(IO_L55P_0)
XP4A_4: U1.J20(IO_L27N_5)
XP4A_5: U1.B26(IO_L12N_M5ODT_5)
XP4A_6: U1.C26(IO_L11N_M5CLKN_5)
XP4A_7: U1.D26(IO_L17N_M5DQ7_5)
XP4A_8: U1.E26(IO_L16N_M5DQ5_5)
XP4A_9: U1.F26(IO_L18N_M5LDQSN_5)
XP4A_29: U1.K26(IO_L21N_M5DQ9_5)
XP4A_30: U1.L26(IO_L24N_M5DQ13_5)
XP4A_31: U1.M26(IO_L23N_M5UDQSN_5)
XP4A_32: U1.N25(IO_L25P_M5DQ14_5)
XP4A_33: U1.N26(IO_L25N_M5DQ15_5)
XP4A_34: U1.U26(IO_L43N_GCLK4_M1DQ5_1)
XP4A_35: U1.U25(IO_L43P_GCLK5_M1DQ4_1)
XP4A_36: U1.Y26(IO_L47N_LDC_M1DQ1_1)
XP4A_37: U1.AA26(IO_L51N_M1DQ13_1)
XP4A_38: U1.AA25(IO_L51P_M1DQ12_1)
XP4B_3: U1.J24(IO_L15N_M5LDM_5)
XP4B_4: U1.K19(IO_L28N_VREF_1)
XP4B_5: U1.C25(IO_L11P_M5CLK_5)
XP4B_6: U1.C24(IO_L3N_M5A11_5)
XP4B_7: U1.E25(IO_L16P_M5DQ4_5)
XP4B_8: U1.F24(IO_L18P_M5LDQS_5)
XP4B_29: U1.N20(IO_L40P_GCLK11_M1A5_1)
XP4B_30: U1.P21(IO_L41P_GCLK9_IRDY1_M1RASN_1)
XP4B_31: U1.P22(IO_L41N_GCLK8_M1CASN_1)
XP4B_32: U1.R22(IO_L55P_1)
XP4B_33: U1.R24(IO_L39N_M1ODT_1)
XP4B_34: U1.R20(IO_L57P_1)
XP4B_35: U1.T22(IO_L59P_1)
XP4B_36: U1.U24(IO_L53N_VREF_1)
XP4B_37: U1.T18(IO_L60P_1)
XP4B_38: U1.T23(IO_L53P_1)
XP4C_3: U1.D22(IO_L4N_M5A12_5)
XP4C_4: U1.E23(IO_L7P_M5WE_5)
XP4C_5: U1.G20(IO_L2P_M5A13_5)
XP4C_6: U1.G21(IO_L2N_M5A14_5)
XP4C_7: U1.E24(IO_L7N_M5BA2_5)
XP4C_8: U1.H24(IO_L19P_M5DQ2_5)
XP4C_29: U1.H26(IO_L19N_M5DQ3_5)
XP4C_30: U1.J26(IO_L22N_M5DQ11_5)
XP4C_31: U1.P10(IO_L49P_M3A7_3)
XP4C_32: U1.J23(IO_L15P_M5UDM_5)
XP4C_33: U1.R23(IO_L39P_M1A3_1)
XP4C_34: U1.H21(IO_L5N_M5A9_5)
XP4C_35: U1.H20(IO_L5P_M5A8_5)
XP4C_36: U1.L21(IO_L26N_VREF_5)
XP4C_37: U1.R21(IO_L55N_1)
XP4C_38: U1.AD24(IO_L48P_HDC_M1DQ8_1)
XP4D_3: U1.G23(IO_L8P_M5A7_5)
XP4D_4: U1.D24(IO_L17P_M5DQ6_5)
XP4D_5: U1.F22(IO_L4P_M5CKE_5)
XP4D_6: U1.G22(IO_L6N_M5A4_5)
XP4D_7: U1.G24(IO_L8N_M5A2_5)
XP4D_8: U1.J25(IO_L22P_M5DQ10_5)
XP4D_22: U1.G26(IO_L20N_M5DQ1_5)
XP4D_23: U1.G25(IO_L20P_M5DQ0_5)
XP4D_29: U1.L19(IO_L28P_1)
XP4D_30: U1.N9(IO_L51N_M3A4_3)
XP4D_31: U1.H22(IO_L6P_M5A10_5)
XP4D_32: U1.H19(IO_L27P_5)
XP4D_33: U1.G19(IO_L9N_M5BA1_5)
XP4D_34: U1.K24(IO_L21P_M5DQ8_5)
XP4D_35: U1.K20(IO_L13P_M5A5_5)
XP4D_36: U1.J22(IO_L14N_M5CASN_5)
XP4D_37: U1.K22(IO_L14P_M5RASN_5)
XP4D_38: U1.T20(IO_L64P_1)
NetD9_A: D9.A(ANODE) R111.2
NetR111_1: R111.1 U43.4(Y)

Not connected (* = marked no-connect by the designer): U1 AF4(IO_L65N_CSO_B_2)* U17(IO_L62P_1)* U19(IO_L70P_1)* U20(IO_L64N_1)*; U43 1(NC)

## Buses and harness runs
bus led[20..1] = port led[20..1]
bus XP1A_[40..1]
bus XP1B_[40..1]
bus XP1C_[40..1]
bus XP1D_[40..1]
bus XP2A_[40..1]
bus XP2B_[40..1]
bus XP2C_[40..1]
bus XP2D_[40..1]
bus XP3A_[40..1]
bus XP3B_[40..1]
bus XP3C_[40..1]
bus XP3D_[40..1]
bus XP4A_[40..1]
bus XP4B_[40..1]
bus XP4C_[40..1]
bus XP4D_[40..1]

## Layout directives
differential pair: gbt_clk40_n, gbt_clk40_p, gbt_clk320_n, gbt_clk320_p

## Notes on the sheet
- XP2
- A1
- 40MHz TTC Clock
- ADC SPI Bus
- The address bus A[25:0] along with the BUSY, FOE_B, FCS_B, and FWE_B pins toggle during configuration. The system should be able to handle activity on these dual-purpose pins during the configuration process
  Using these as LED outputs, for example, is a safe option
  CSO_B
  DOUT_BUSY
  FCS
  FWE
  FOE
  _A[25..0]_
  these are marked on the schematic by ****
- XP4
- XP1
- OUTPUT ONLY on Address Pins
- 0=GBTx FEC; 1=GBTx widebus
- (near U39) pulled up to 1.5v
- blocked by cap
- XP3
- Date:
- Rev:
- Sheet
- of
- (in symbol XC6SLX100-3FGG676C, part A) BANK 0
- (in symbol XC6SLX100-3FGG676C, part B) ****; BANK 1
- (in symbol XC6SLX100-3FGG676C, part C) BANK 2; ****
- (in symbol XC6SLX100-3FGG676C, part D) BANK 3
- (in symbol XC6SLX100-3FGG676C, part E) BANK 4
- (in symbol XC6SLX100-3FGG676C, part F) BANK 5

## Library data of the parts
D9 = LTST-C193KGKT-5A: LED GREEN CLEAR 0603 SMD; Manufacturer: Lite-On Inc.; Current - Test: 5mA; Lens Color: Colorless; Lens Style/Size: Rectangle with Flat Top, 1.15mm x 0.80mm; Millicandela Rating: 16.25mcd; Viewing Angle: 130°; Voltage - Forward (Vf) (Typ): 2V; Wavelength - Dominant: 572nm; Wavelength - Peak: 574nm; Category: Optoelectronics; Color: Green; ComponentLink1Description: http://optoelectronics.liteon.com/upload/download/DS22-2007-0094/LTST-C193KGKT-5A.PDF; ComponentLink1URL: http://optoelectronics.liteon.com/upload/download/DS22-2007-0094/LTST-C193KGKT-5A.PDF; Features: -; Height (Max): 0.45mm; Lens Transparency: Clear; Manufacturer Part Number: LTST-C193KGKT-5A; Mounting Type: Surface Mount; Package / Case: 0603 (1608 Metric); Packaging: Cut Tape (CT); Part Status: Active; Pricing 1: 1=0.41, 10=0.296, 25=0.2268, 100=0.148, 250=0.10852, 500=0.0921, 1000=0.07565, 2500=0.06578 (USD); Pricing 2: 1=0.41, 10=0.296, 25=0.2268, 100=0.148, 250=0.10852, 500=0.0921, 1000=0.07565, 2500=0.06578 (USD); RoHS: RoHS Compliant; Size / Dimension: 1.60mm L x 0.80mm W; Stock 1: 83440; Stock 2: 83440; Supplier 1: Digi-Key; Supplier 2: Digi-Key; Supplier Device Package: Chip LED; Supplier Part Number 1: 160-1828-1-ND; Supplier Part Number 2: 160-1828-6-ND
R91 R92 = ERJ-2RKF1100X: RES SMD 110 OHM 1% 1/10W 0402; Manufacturer: Panasonic Electronic Components; Power (Watts): 0.1W, 1/10W; Temperature Coefficient: ±100ppm/°C; Supplier 1: Digi-Key; Manufacturer Part Number: ERJ-2RKF1100X; RoHS: RoHS Compliant; Category: Resistors; Stock 1: 171366; Pricing 1: 1=0.1, 10=0.039, 100=0.016, 1000=0.00719, 2500=0.00624, 5000=0.00515 (USD); Packaging: Cut Tape (CT); Part Status: Active; Composition: Thick Film; Features: Automotive AEC-Q200; Operating Temperature: -55°C ~ 155°C; Package / Case: 0402 (1005 Metric); Size / Dimension: 0.039" L x 0.020" W (1.00mm x 0.50mm); Height - Seated (Max): 0.016" (0.40mm); Failure Rate: -; ComponentLink1URL: https://industrial.panasonic.com/cdbs/www-data/pdf/RDA0000/AOA0000C304.pdf; ComponentLink1Description: https://industrial.panasonic.com/cdbs/www-data/pdf/RDA0000/AOA0000C304.pdf; Supplier 2: Digi-Key; Stock 2: 171366; Pricing 2: 1=0.1, 10=0.039, 100=0.016, 1000=0.00719, 2500=0.00624, 5000=0.00515 (USD); Supplier Part Number 1: P110LCT-ND; Supplier Part Number 2: P110LDKR-ND; Tolerance: ±1%
R98 = CR0603-FX-4701ELF: RES SMD 4.7K OHM 1% 1/10W 0603; Manufacturer: Bourns Inc.; Power (Watts): 0.1W, 1/10W; Temperature Coefficient: ±100ppm/°C; Tolerance: ±1%; Supplier 1: Digi-Key; Manufacturer Part Number: CR0603-FX-4701ELF; RoHS: RoHS Compliant; Category: Resistors; Stock 1: 43560; Pricing 1: 1=0.1, 10=0.021, 100=0.0086, 1000=0.00385, 2500=0.00334 (USD); Packaging: Cut Tape (CT); Part Status: Active; Resistance (Ohms): 4.7k; Composition: Thick Film; Features: Moisture Resistant; Operating Temperature: -55°C ~ 155°C; Package / Case: 0603 (1608 Metric); Size / Dimension: 0.063" L x 0.031" W (1.60mm x 0.80mm); Height - Seated (Max): 0.022" (0.55mm); Failure Rate: -; ComponentLink1URL: http://www.bourns.com/docs/Product-Datasheets/CHPREZTR.pdf; ComponentLink1Description: http://www.bourns.com/docs/Product-Datasheets/CHPREZTR.pdf; Supplier 2: Digi-Key; Stock 2: 43560; Pricing 2: 1=0.1, 10=0.021, 100=0.0086, 1000=0.00385, 2500=0.00334 (USD); Supplier Part Number 1: CR0603-FX-4701ELFCT-ND; Supplier Part Number 2: CR0603-FX-4701ELFDKR-ND
R111 = CR0603-FX-3300ELF: RES SMD 330 OHM 1% 1/10W 0603; Manufacturer: Bourns Inc.; Power (Watts): 0.1W, 1/10W; Temperature Coefficient: ±100ppm/°C; Resistance (Ohms): 330; Supplier 1: Digi-Key; Manufacturer Part Number: CR0603-FX-3300ELF; RoHS: RoHS Compliant; Category: Resistors; Stock 1: 45245; Pricing 1: 1=0.1, 10=0.023, 100=0.0092, 1000=0.00414, 2500=0.00359 (USD); Packaging: Cut Tape (CT); Part Status: Active; Composition: Thick Film; Features: Moisture Resistant; Operating Temperature: -55°C ~ 155°C; Package / Case: 0603 (1608 Metric); Size / Dimension: 0.063" L x 0.031" W (1.60mm x 0.80mm); Height - Seated (Max): 0.022" (0.55mm); Failure Rate: -; ComponentLink1URL: http://www.bourns.com/docs/Product-Datasheets/CHPREZTR.pdf; ComponentLink1Description: http://www.bourns.com/docs/Product-Datasheets/CHPREZTR.pdf; Supplier Part Number 1: CR0603-FX-3300ELFCT-ND; Tolerance: ±1%; Supplier 2: Digi-Key; Stock 2: 45245; Pricing 2: 1=0.1, 10=0.023, 100=0.0092, 1000=0.00414, 2500=0.00359 (USD); Supplier Part Number 2: CR0603-FX-3300ELFDKR-ND
U1 = XC6SLX100-3FGG676C: Manufacturer: Xilinx Inc.; Voltage - Supply: 1.14 V ~ 1.26 V; Supplier 1: Digi-Key; Manufacturer Part Number: XC6SLX100-3FGG676C; RoHS: RoHS Compliant; Category: Integrated Circuits (ICs); Stock 1: 275; Pricing 1: 1=145.6 (USD); Part Status: Active; Mounting Type: Surface Mount; Operating Temperature: 0°C ~ 85°C (TJ); Package / Case: 676-BGA; Supplier Device Package: 676-FBGA (27x27); ComponentLink1URL: http://www.xilinx.com/support/documentation/data_sheets/ds162.pdf; ComponentLink1Description: http://www.xilinx.com/support/documentation/data_sheets/ds162.pdf; Supplier Part Number 1: 122-1760-ND
U39 = SN74LVC1G07-EP: IC BUFF/DVR NON-INVERT Open Drain SC70-5; Manufacturer: Texas Instruments; mfgr_id: SN74LVC1G07MDCKREP; mfgr: Texas Inst; mfgr_foot: DCK; COMPROT: 270; COMPGROUP: 0; COMPSIDE: TOP; Logic Type: Buffer, Non-Inverting; Number of Bits per Element: 1; Current - Output High, Low: -, 32mA; Voltage - Supply: 1.65 V ~ 5.5 V; Package: 99; Supplier 1: Digi-Key; Manufacturer Part Number: SN74LVC1G07MDCKREP; RoHS: RoHS Compliant; Category: Integrated Circuits (ICs); Stock 1: 4252; Pricing 1: 1=0.81, 10=0.714, 100=0.5472, 500=0.4326, 1000=0.34608 (USD); Packaging: Cut Tape (CT); Part Status: Active; Input Type: -; Output Type: Open Drain; Operating Temperature: -55°C ~ 125°C (TA); Mounting Type: Surface Mount; Package / Case: 5-TSSOP, SC-70-5, SOT-353; Supplier Device Package: SC-70-5; ComponentLink1URL: http://www.ti.com/lit/ds/symlink/sn74lvc1g07-ep.pdf; ComponentLink1Description: http://www.ti.com/lit/ds/symlink/sn74lvc1g07-ep.pdf; Supplier 2: Digi-Key; Stock 2: 4252; Pricing 2: 1=0.81, 10=0.714, 100=0.5472, 500=0.4326, 1000=0.34608 (USD); Supplier Part Number 1: 296-22343-1-ND; Supplier Part Number 2: 296-22343-6-ND
U43 = SN74LVC1G34DRLR: IC BUFFER NON-INVERT SOT5; Manufacturer: Texas Instruments; mfgr: Texas Inst; mfgr_foot: DRL; COMPROT: 270; COMPGROUP: 0; COMPSIDE: TOP; Logic Type: Buffer, Non-Inverting; Number of Bits per Element: 1; Output Type: Push-Pull; Current - Output High, Low: 32mA, 32mA; Voltage - Supply: 1.65 V ~ 5.5 V; mfgr_id: SN74LVC1G34DRLR; Package: 99; Supplier 1: Digi-Key; Manufacturer Part Number: SN74LVC1G34DRLR; RoHS: RoHS Compliant; Category: Integrated Circuits (ICs); Stock 1: 1633; Pricing 1: 1=0.48, 10=0.387, 100=0.2637, 500=0.19776, 1000=0.14832 (USD); Packaging: Cut Tape (CT); Part Status: Active; Input Type: -; Operating Temperature: -40°C ~ 125°C (TA); Mounting Type: Surface Mount; Package / Case: SOT-553; Supplier Device Package: SOT-5; ComponentLink1URL: http://www.ti.com/lit/ds/symlink/sn74lvc1g34.pdf; ComponentLink1Description: http://www.ti.com/lit/ds/symlink/sn74lvc1g34.pdf; Supplier 2: Digi-Key; Stock 2: 1633; Pricing 2: 1=0.48, 10=0.387, 100=0.2637, 500=0.19776, 1000=0.14832 (USD); Supplier Part Number 1: 296-18017-1-ND; Supplier Part Number 2: 296-18017-6-ND